# EAGLE design capactive hub (EAGLE 8.2.2)
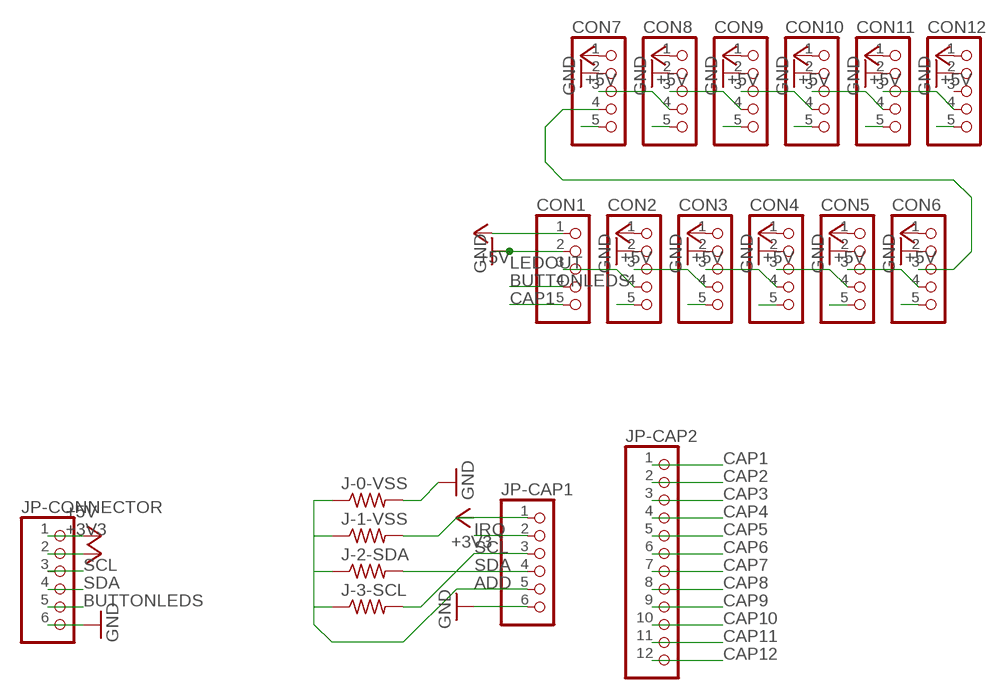
[diagram p0: schematic, sheet 1]

## Parts
CON1  PINHD-1X5  [1X05]
CON2  PINHD-1X5  [1X05]
CON3  PINHD-1X5  [1X05]
CON4  PINHD-1X5  [1X05]
CON5  PINHD-1X5  [1X05]
CON6  PINHD-1X5  [1X05]
CON7  PINHD-1X5  [1X05]
CON8  PINHD-1X5  [1X05]
CON9  PINHD-1X5  [1X05]
CON10  PINHD-1X5  [1X05]
CON11  PINHD-1X5  [1X05]
CON12  PINHD-1X5  [1X05]
J-0-VSS  RES-US1206FAB  [R1206FAB]
J-1-VSS  RES-US1206FAB  [R1206FAB]
J-2-SDA  RES-US1206FAB  [R1206FAB]
J-3-SCL  RES-US1206FAB  [R1206FAB]
JP-CAP1  PINHD-1X6  [1X06]
JP-CAP2  PINHD-1X12  [1X12]
JP-CONNECTOR  PINHD-1X6  [1X06]

## Nets
+3V3: J-1-VSS.2 JP-CAP1.1 JP-CONNECTOR.2
+5V: CON1.1 CON2.1 CON3.1 CON4.1 CON5.1 CON6.1 CON7.1 CON8.1 CON9.1 CON10.1 CON11.1 CON12.1 JP-CONNECTOR.1
ADD: J-0-VSS.1 J-1-VSS.1 J-2-SDA.1 J-3-SCL.1 JP-CAP1.5
BUTTONLEDS: CON1.4 JP-CONNECTOR.5
CAP1: CON1.5 JP-CAP2.1
CAP2: CON2.5 JP-CAP2.2
CAP3: CON3.5 JP-CAP2.3
CAP4: CON4.5 JP-CAP2.4
CAP5: CON5.5 JP-CAP2.5
CAP6: CON6.5 JP-CAP2.6
CAP7: CON7.5 JP-CAP2.7
CAP8: CON8.5 JP-CAP2.8
CAP9: CON9.5 JP-CAP2.9
CAP10: CON10.5 JP-CAP2.10
CAP11: CON11.5 JP-CAP2.11
CAP12: CON12.5 JP-CAP2.12
GND: CON1.2 CON2.2 CON3.2 CON4.2 CON5.2 CON6.2 CON7.2 CON8.2 CON9.2 CON10.2 CON11.2 CON12.2 J-0-VSS.2 JP-CAP1.6 JP-CONNECTOR.6
IRQ: JP-CAP1.2
LEDOUT: CON1.3 CON2.4
N$16: CON2.3 CON3.4
N$17: CON3.3 CON4.4
N$18: CON4.3 CON5.4
N$19: CON5.3 CON6.4
N$20: CON6.3 CON7.4
N$21: CON7.3 CON8.4
N$22: CON8.3 CON9.4
N$23: CON9.3 CON10.4
N$24: CON10.3 CON11.4
N$25: CON11.3 CON12.4
SCL: J-3-SCL.2 JP-CAP1.3 JP-CONNECTOR.3
SDA: J-2-SDA.2 JP-CAP1.4 JP-CONNECTOR.4
Unconnected: CON12.3

## Library data of the parts
CON1-CON12 = pinhead:PINHD-1X5: PIN HEADER
J-0-VSS J-1-VSS J-2-SDA J-3-SCL = fab:RES-US: Resistor (US Symbol) Variants with postfix FAB are widened to allow the routing of internal traces
JP-CAP1 JP-CONNECTOR = pinhead:PINHD-1X6: PIN HEADER
JP-CAP2 = pinhead:PINHD-1X12: PIN HEADER

## Board
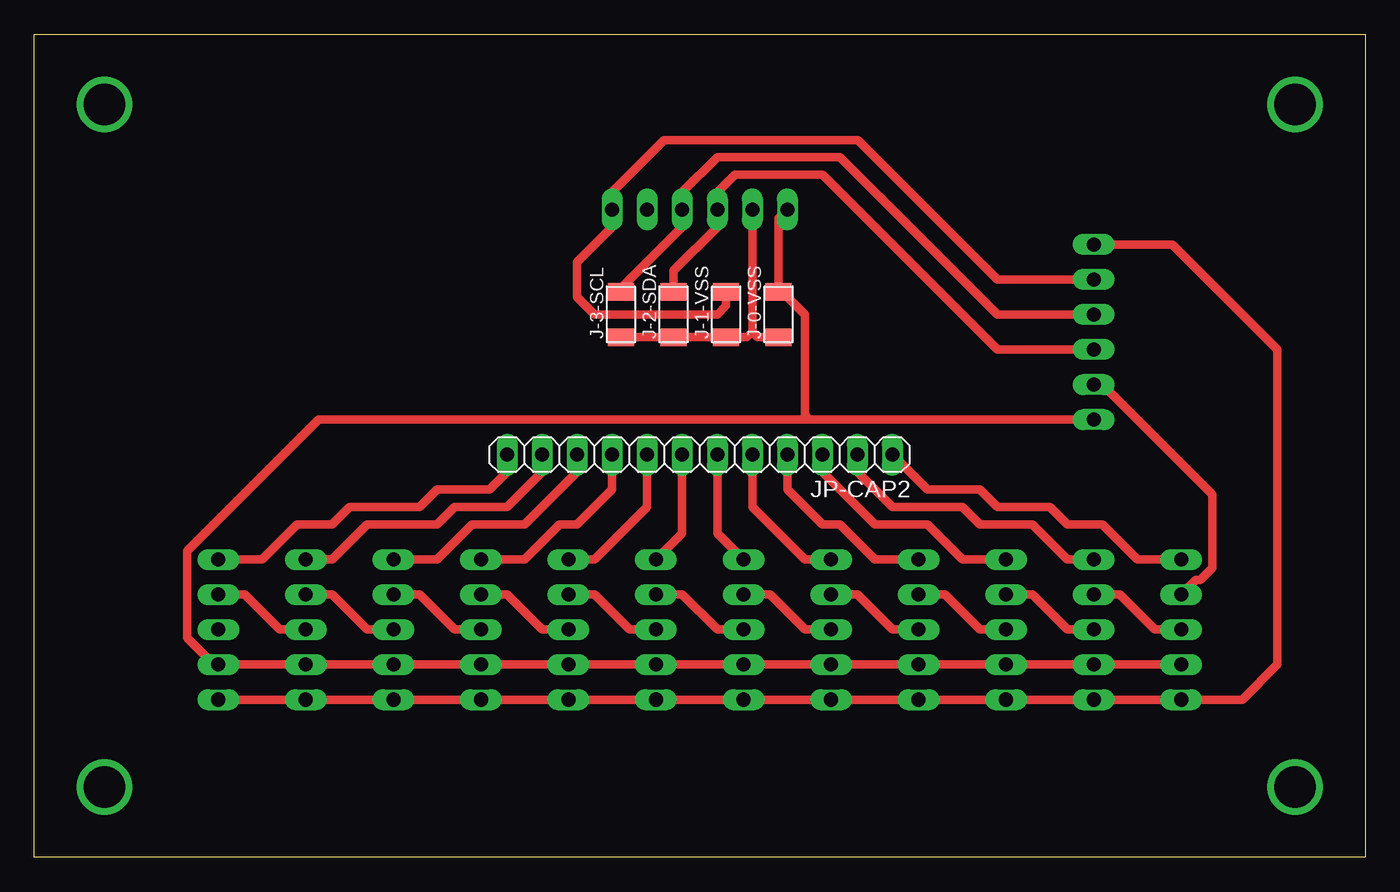
[diagram p1: board, top side]
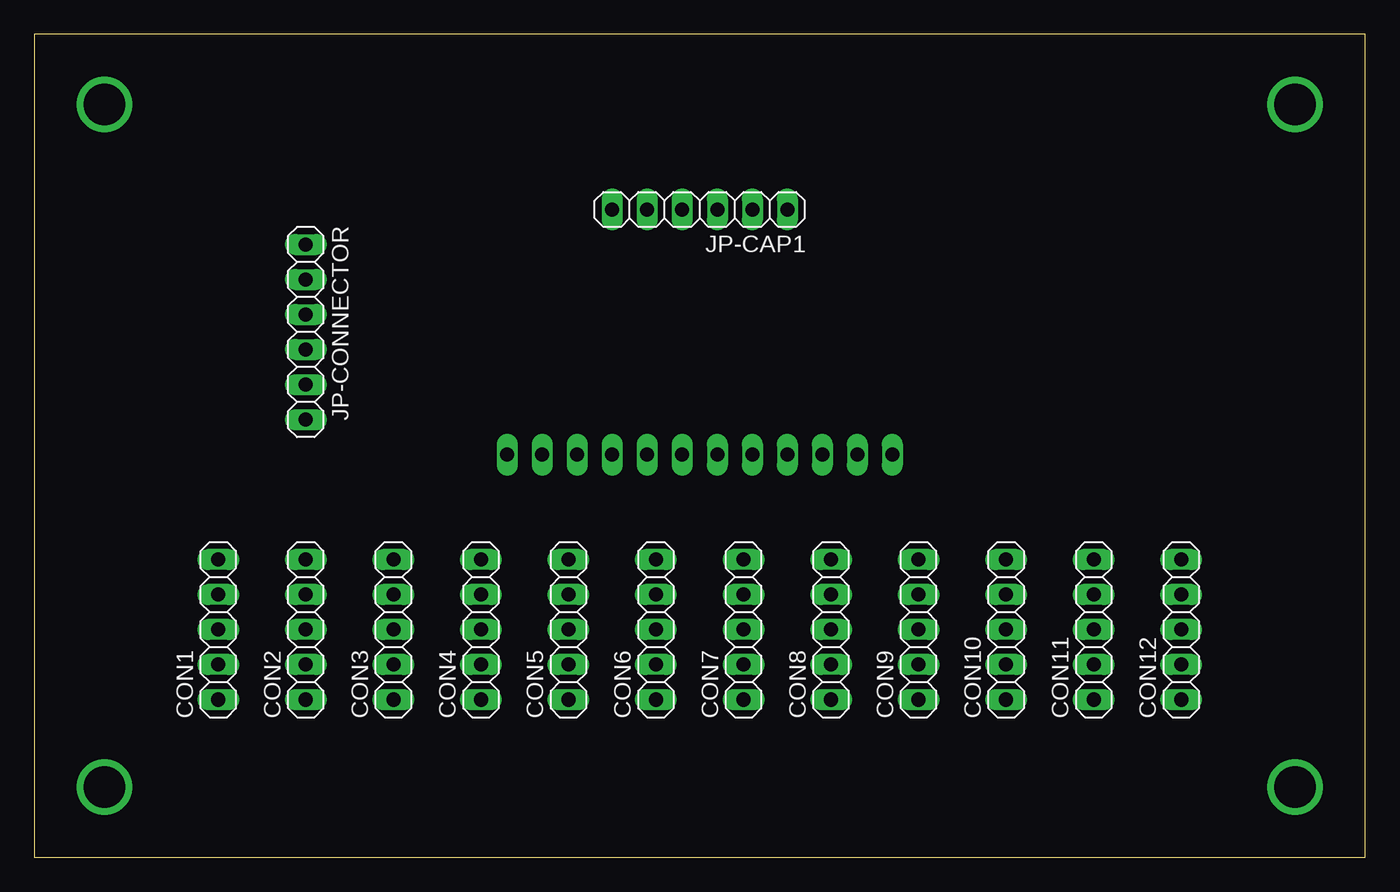
[diagram p2: board, bottom side, seen from below]

Size 96.52 x 59.69 mm. Coordinates in mm from the lower left corner, seen from the top.
Outline: 96.52,0 0,0 0,59.69 96.52,59.69 96.52,0
Copper layers (1*16): Top 0.035mm / dielectric 1.5mm / Bottom 0.035mm
Design rules "fabmodule *": minimum track width 0.6mm, minimum drill 0.4mm, track to track 0.42mm, track to pad 0.42mm, pad to pad 0.42mm, via to via 0.42mm, smd to smd 0.42mm, copper to edge 40mil, drill to drill 0.8mm, minimum pad ring 10mil, minimum via ring 8mil, stop-mask expansion 4mil, vias tented up to drill 0mil, thermal gap 10mil

### Footprints (pad centres in the part's own frame; a part is rotated, then mirrored left to right if it is on the bottom)
1X05 = drill 1.016 long: 1 -5.08,0; 2 -2.54,0; 3 0,0; 4 2.54,0; 5 5.08,0
R1206FAB = smd 1.27 x 1.905: 1 -1.651,0; 2 1.651,0
1X06 = drill 1.016 long: 1 -6.35,0; 2 -3.81,0; 3 -1.27,0; 4 1.27,0; 5 3.81,0; 6 6.35,0
1X12 = drill 1.016 long: 1 -13.97,0; 2 -11.43,0; 3 -8.89,0; 4 -6.35,0; 5 -3.81,0; 6 -1.27,0; 7 1.27,0; 8 3.81,0; 9 6.35,0; 10 8.89,0; 11 11.43,0; 12 13.97,0

### Placement (x,y rotation side)
CON1  83.19,16.51 90 bottom
CON2  76.83,16.51 90 bottom
CON3  70.48,16.51 90 bottom
CON4  64.14,16.51 90 bottom
CON5  57.79,16.51 90 bottom
CON6  51.44,16.51 90 bottom
CON7  45.09,16.51 90 bottom
CON8  38.74,16.51 90 bottom
CON9  32.38,16.51 90 bottom
CON10  26.04,16.51 90 bottom
CON11  19.68,16.51 90 bottom
CON12  13.33,16.51 90 bottom
J-0-VSS  53.98,39.37 90 top
J-1-VSS  50.17,39.37 90 top
J-2-SDA  46.36,39.37 90 top
J-3-SCL  42.55,39.37 90 top
JP-CAP1  48.26,46.99 180 bottom
JP-CAP2  48.26,29.21 180 top
JP-CONNECTOR  76.83,38.1 270 bottom

### Tracks (layer width: path | path; a pad name or v marks a point on that pad's centre or on a via)
+3V3
  Top 0.61: JP-CONNECTOR.2 69.85,41.91 59.74,52.02 45.67,52.02 41.91,48.26 JP-CAP1.1 41.91,45.72 40.64,44.45 39.37,43.18 39.37,40.64 40.64,39.37 49.53,39.37 50.17,40.01 J-1-VSS.2
+5V
  Top 0.61: CON9.1 CON8.1 CON7.1 CON6.1 CON5.1 CON4.1 CON3.1 CON2.1 CON1.1 87.63,11.43 90.17,13.97 90.17,36.83 82.55,44.45 JP-CONNECTOR.1 | CON9.1 31.75,11.43 CON9.1 | CON9.1 CON10.1 CON11.1 CON12.1
ADD
  Top 0.61: 52.07,38.1 JP-CAP1.5 | 52.07,38.1 51.69,37.72 J-1-VSS.1 J-2-SDA.1 J-3-SCL.1 | J-0-VSS.1 52.45,37.72 52.07,38.1
BUTTONLEDS
  Top 0.61: CON1.4 84.24,20.1 84.56,20.1 85.43,20.97 85.43,26.33 77.47,34.29 JP-CONNECTOR.5
CAP1
  Top 0.61: JP-CAP2.1 64.77,26.67 68.58,26.67 69.85,25.4 73.66,25.4 74.93,24.13 77.47,24.13 80.01,21.59 CON1.5
CAP2
  Top 0.61: JP-CAP2.2 59.69,27.94 62.23,25.4 67.31,25.4 68.58,24.13 72.39,24.13 74.93,21.59 CON2.5
CAP3
  Top 0.61: JP-CAP2.3 57.15,27.94 60.96,24.13 64.77,24.13 67.31,21.59 CON3.5
CAP4
  Top 0.61: JP-CAP2.4 54.61,26.67 57.15,24.13 58.42,24.13 60.96,21.59 CON4.5
CAP5
  Top 0.61: JP-CAP2.5 52.07,25.4 55.88,21.59 CON5.5
CAP6
  Top 0.61: CON6.5 49.53,23.5 JP-CAP2.6
CAP7
  Top 0.61: CON7.5 46.99,23.5 JP-CAP2.7
CAP8
  Top 0.61: JP-CAP2.8 44.45,25.4 40.64,21.59 CON8.5
CAP9
  Top 0.61: JP-CAP2.9 41.91,26.67 39.37,24.13 38.1,24.13 35.56,21.59 CON9.5
CAP10
  Top 0.61: JP-CAP2.10 39.37,27.94 35.56,24.13 31.75,24.13 29.21,21.59 CON10.5
CAP11
  Top 0.61: JP-CAP2.11 36.83,27.94 34.29,25.4 30.48,25.4 29.21,24.13 24.13,24.13 21.59,21.59 CON11.5
CAP12
  Top 0.61: JP-CAP2.12 34.29,27.94 33.02,26.67 29.21,26.67 27.94,25.4 22.86,25.4 21.59,24.13 19.05,24.13 16.51,21.59 CON12.5
GND
  Top 0.61: 32.62,13.97 CON10.2 CON11.2 CON12.2 12.7,13.97 12.7,14.28 11.09,15.89 11.09,22.21 20.63,31.75 56.24,31.75 | 32.62,13.97 33.02,13.97 | 32.62,13.97 CON8.2 CON7.2 CON6.2 CON5.2 CON4.2 CON3.2 CON2.2 CON1.2 83.82,13.97 | 56.24,31.75 JP-CONNECTOR.6 | JP-CAP1.6 53.98,46.36 J-0-VSS.2 54.23,41.02 55.88,39.37 55.88,32.11 56.24,31.75 | CON9.2 32.62,13.97
LEDOUT
  Top 0.61: CON2.4 78.74,19.05 81.28,16.51 CON1.3
N$1  (via drill 3)
  other vias: 5.08,54.61
N$2  (via drill 3)
  other vias: 5.08,5.08
N$3  (via drill 3)
  other vias: 91.44,5.08
N$4  (via drill 3)
  other vias: 91.44,54.61
N$16
  Top 0.61: CON3.4 72.39,19.05 74.93,16.51 CON2.3
N$17
  Top 0.61: CON4.4 66.04,19.05 68.58,16.51 CON3.3
N$18
  Top 0.61: CON5.4 59.69,19.05 62.23,16.51 CON4.3
N$19
  Top 0.61: CON6.4 53.34,19.05 55.88,16.51 CON5.3
N$20
  Top 0.61: CON7.4 46.99,19.05 49.53,16.51 CON6.3
N$21
  Top 0.61: CON8.4 40.64,19.05 43.18,16.51 CON7.3
N$22
  Top 0.61: CON9.4 34.29,19.05 36.83,16.51 CON8.3
N$23
  Top 0.61: CON10.4 27.94,19.05 30.48,16.51 CON9.3
N$24
  Top 0.61: CON11.4 21.59,19.05 24.13,16.51 CON10.3
N$25
  Top 0.61: CON12.4 15.24,19.05 17.78,16.51 CON11.3
SCL
  Top 0.61: J-3-SCL.2 42.55,41.28 46.99,45.72 JP-CAP1.3 46.99,48.26 49.53,50.8 58.42,50.8 69.85,39.37 JP-CONNECTOR.3
SDA
  Top 0.61: J-2-SDA.2 46.36,42.55 49.53,45.72 JP-CAP1.4 49.53,48.26 50.8,49.53 57.15,49.53 69.85,36.83 JP-CONNECTOR.4